# EAGLE schematic ATtiny85 Board (EAGLE 8.5.2)
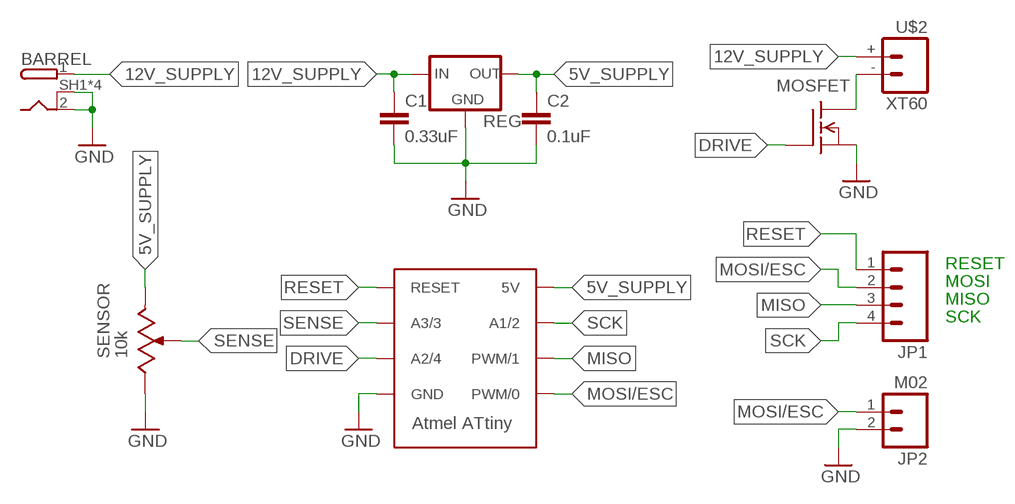
[diagram p0: schematic, sheet 1]

## Parts
BARREL  PJ-082BH  [PJ-082BH]
C1  0.33uF  CAP0805  [0805]
C2  0.1uF  CAP0805  [0805]
JP1  M04  [1X04]
JP2  M02  [1X02]
MOSFET  SI2312  [SOT-23]
REG  L78L  [SOT-89]
SENSOR  10k  SV03  [SV03A]
U$1  ATTINY  [8S2]
U$2  XT60  [XT60]

## Nets
5V_SUPPLY: C2.1 REG.1(OUT) SENSOR.1(E) U$1.8(5V)
12V_SUPPLY: BARREL.1(PWR) C1.1 REG.3(IN) U$2.+
DRIVE: MOSFET.1(G) U$1.3(A2/4)
GND: BARREL.2(GND) BARREL.SH1(SHIELD) BARREL.SH2(SHIELD) BARREL.SH3(SHIELD) BARREL.SH4(SHIELD) C1.2 C2.2 JP2.2 MOSFET.2(S) REG.2(GND) REG.2.1(GND) REG.2.2(GND) SENSOR.3(A) U$1.4(GND)
MISO: JP1.3 U$1.6(PWM/1)
MOSI/ESC: JP1.2 JP2.1 U$1.5(PWM/0)
N$3: MOSFET.3(D) U$2.-
RESET: JP1.1 U$1.1(RESET)
SCK: JP1.4 U$1.7(A1/2)
SENSE: SENSOR.2(S) SENSOR.2.1(S) U$1.2(A3/3)

## Notes on the sheet
- RESET
- MOSI
- MISO
- SCK

## Library data of the parts
BARREL = Controls Library:PJ-082BH: CUI Inc. Shielded DC Power Jack 10 A Current Rating Datasheet <http://www.cui.com/product/resource/pj-082bh.pdf>
C1 C2 = Controls Library:CAP: Capacitor Standard 0603 ceramic capacitor, and 0.1" leaded capacitor.
JP1 = Controls Library:M04: Standard 4-pin 0.1" header. NOTES ON THE VARIANTS LOCK and LOCK_LONGPADS... This footprint was designed to help hold the alignment of a through-hole component (i.e. 6-pin header) while soldering it into place. You may notice that each hole has been shifted either up or down by 0.005 of an inch from it's more standard position (which is a perfectly straight line). This slight alteration caused the pins (the squares in the middle) to touch the edges of the holes. Because they are alternating, it causes a "brace" to hold the component in place. 0.005 has proven to be the perfect amount of "off-center" position when using our standard breakaway headers. Although looks a little odd when you look at the bare footprint, once you have a header in there, the alteration is very hard to notice. Also,if you push a header all the way into place, it is covered up entirely on the bottom side. This idea of altering the position of holes to aid alignment will be further integrated into the Sparkfun Library for other footprints. It can help hold any component with 3 or more connection pins. Note: The Sparkfun version includes many other packages including surface mount that may be of future interest. Source: Sparkfun <https://github.com/sparkfun/SparkFun-Eagle-Libraries>
JP2 = Controls Library:M02: Standard 2-pin 0.1" header. NOTES ON THE VARIANTS LOCK and LOCK_LONGPADS... This footprint was designed to help hold the alignment of a through-hole component (i.e. 6-pin header) while soldering it into place. You may notice that each hole has been shifted either up or down by 0.005 of an inch from it's more standard position (which is a perfectly straight line). This slight alteration caused the pins (the squares in the middle) to touch the edges of the holes. Because they are alternating, it causes a "brace" to hold the component in place. 0.005 has proven to be the perfect amount of "off-center" position when using our standard breakaway headers. Although looks a little odd when you look at the bare footprint, once you have a header in there, the alteration is very hard to notice. Also,if you push a header all the way into place, it is covered up entirely on the bottom side. This idea of altering the position of holes to aid alignment will be further integrated into the Sparkfun Library for other footprints. It can help hold any component with 3 or more connection pins. Note: The Sparkfun version includes many other packages including surface mount that may be of future interest. Source: Sparkfun <https://github.com/sparkfun/SparkFun-Eagle-Libraries>
MOSFET = Controls Library:SI2312: Micro Commerical Components N-Channel MOSFET Vds: 20 V (MAX) Id: 5A (MAX) Vgs: 8 V (MAX) Rds(on): 0.0318 Ohms (Vgs=4.5V, ID=5.0A) Datasheet <http://www.mccsemi.com/up_pdf/SI2312(SOT-23).pdf>
REG = Controls Library:L78L: STMicroelectronics Positive Voltage Regulator Vout: 3.3; 5; 6; 8; 9; 10; 12; 15; 18; 24V Iout: 100mA (MAX) Datasheet <http://www.st.com/content/ccc/resource/technical/document/datasheet/15/55/e5/aa/23/5b/43/fd/CD00000446.pdf/files/CD00000446.pdf/jcr:content/translations/en.CD00000446.pdf>
SENSOR = Controls Library:SV03: Murata SV03 Series Rotary Position Sensor Total Resistance: 10 kOhms +/-30% Linearity: +/-2% Effective Rotational Angle: 333.3° Rated Voltage: 5V Datasheet <https://www.murata.com/~/media/webrenewal/support/library/catalog/products/sensor/rotaryposition/r51e.ashx>
U$1 = Controls Library:ATTINY: Atmel 8-bit AVR Microcontroller 2/4/8KB Programmable Flash 0-20 MHz @ 4.5-5.5V 10-bit ADC Datasheet <http://ww1.microchip.com/downloads/en/DeviceDoc/Atmel-2586-AVR-8-bit-Microcontroller-ATtiny25-ATtiny45-ATtiny85_Datasheet.pdf>
U$2 = Controls Library:XT60